# EAGLE design CW_Encoder (EAGLE 6.6.0)

## Sheet 1 of 2

## Sheet 2 of 2
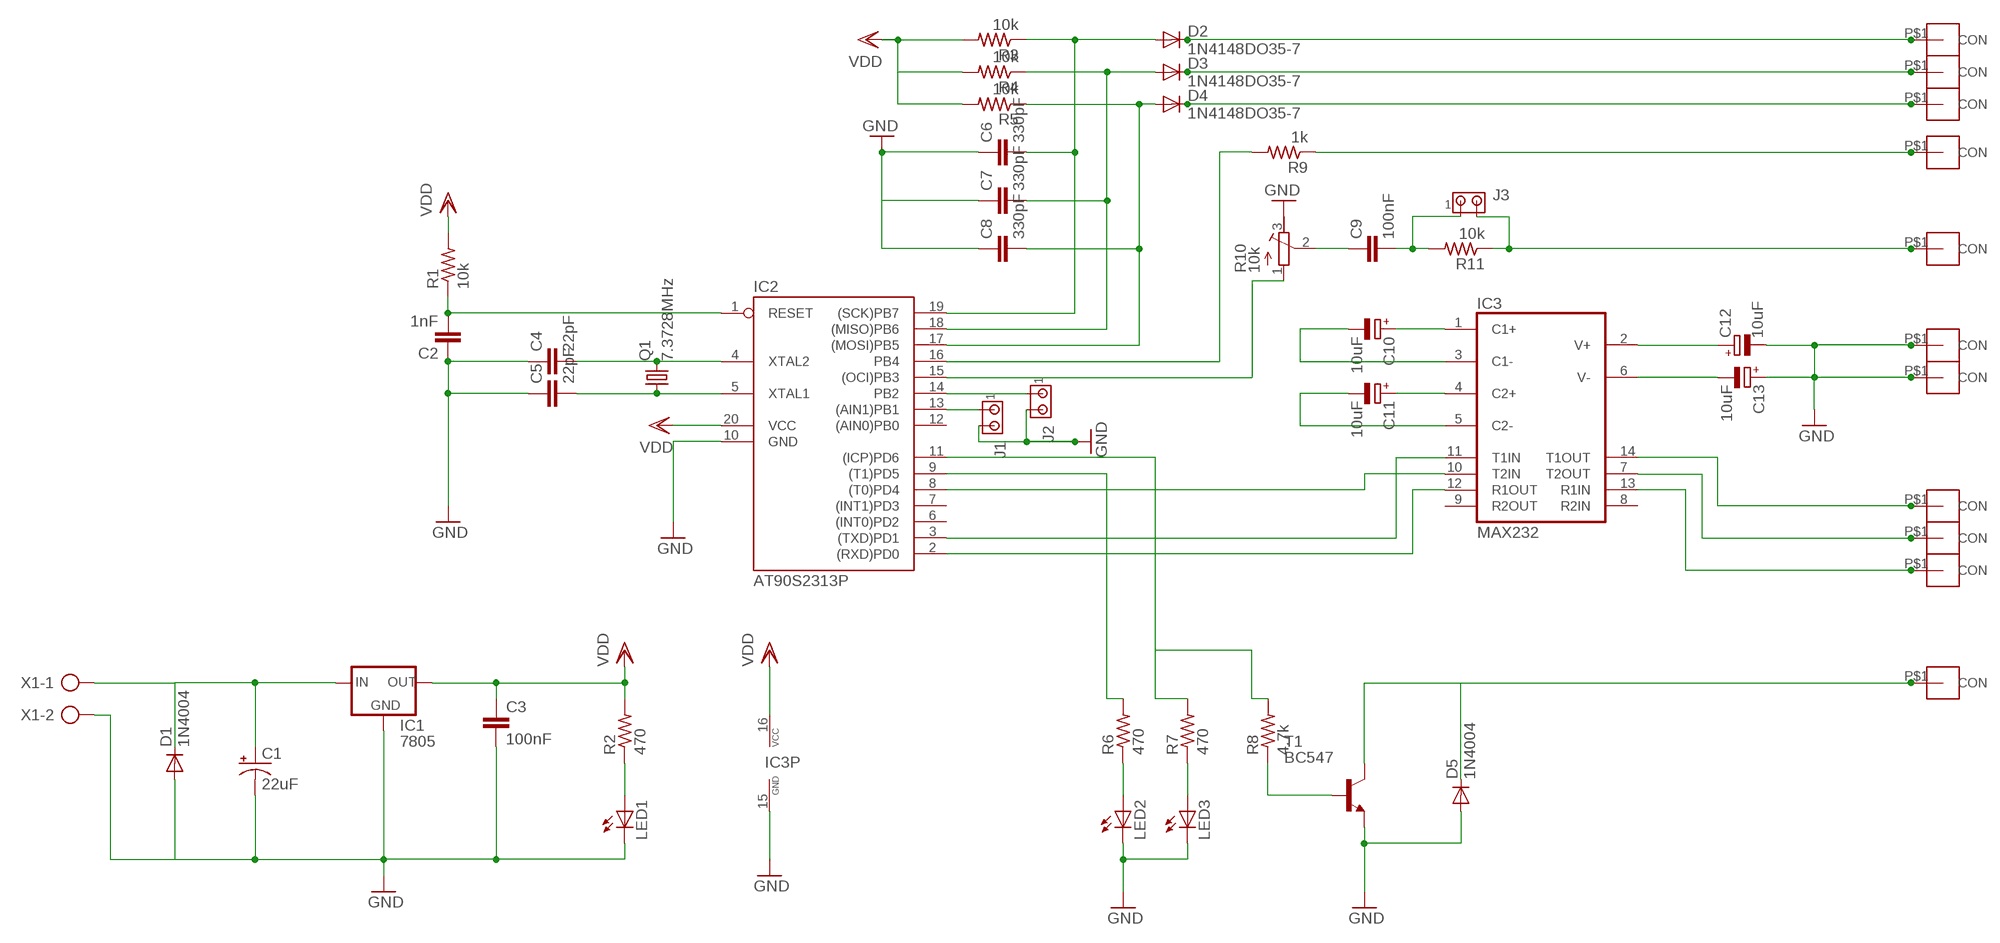
[diagram p0: schematic, sheet 2]

### Parts
C1  22uF  CPOL-USE2.5-5V  [E2,5-4R]
C2  1nF  C-EU025-024X044  [C025-024X044]
C3  100nF  C-EU025-024X044  [C025-024X044]
C4  22pF  C-EU025-024X044  [C025-024X044]
C5  22pF  C-EU025-024X044  [C025-024X044]
C6  330pF  C-EU025-024X044  [C025-024X044]
C7  330pF  C-EU025-024X044  [C025-024X044]
C8  330pF  C-EU025-024X044  [C025-024X044]
C9  100nF  C-EU025-024X044  [C025-024X044]
C10  10uF  CPOL-EUB45181A  [B45181A]
C11  10uF  CPOL-EUB45181A  [B45181A]
C12  10uF  CPOL-EUB45181A  [B45181A]
C13  10uF  CPOL-EUB45181A  [B45181A]
CTS  CON1  [CON1]
CWOUT  CON1  [CON1]
D1  1N4004  [DO41-10]
D2  1N4148DO35-7  [DO35-7]
D3  1N4148DO35-7  [DO35-7]
D4  1N4148DO35-7  [DO35-7]
D5  1N4004  [DO41-10]
GND  CON1  [CON1]
GND_  CON1  [CON1]
IC1  7805  78XXL  [78XXL]
IC2  AT90S2313P  [DIL20]
IC3  MAX232  [DIL16]
IN1  CON1  [CON1]
IN2  CON1  [CON1]
J1  MTA02-100  [10X02MTA]
J2  MTA02-100  [10X02MTA]
J3  MTA02-100  [10X02MTA]
LED1  LED5MM  [LED5MM]
LED2  LED5MM  [LED5MM]
LED3  LED5MM  [LED5MM]
POSAGOUT  CON1  [CON1]
PTT  CON1  [CON1]
Q1  7.3728MHz  CRYSTALHC49S  [HC49/S]
R1  10k  R-US_0204/7  [0204/7]
R2  470  R-US_0204/7  [0204/7]
R3  10k  R-US_0204/7  [0204/7]
R4  10k  R-US_0204/7  [0204/7]
R5  10k  R-US_0204/7  [0204/7]
R6  470  R-US_0204/7  [0204/7]
R7  470  R-US_0204/7  [0204/7]
R8  4.7k  R-US_0204/7  [0204/7]
R9  1k  R-US_0204/7  [0204/7]
R10  10k  R-TRIMM3339P  [RTRIM3339P]
R11  10k  R-US_0204/7  [0204/7]
T1  BC547  [TO92]
TX  tx  CON1  [CON1]
TXD  CON1  [CON1]
U$1  CON1  [CON1]
X1  AK300/2  [AK300/2]

### Nets
GND: C1.- C2.1 C3.2 C4.1 C5.1 C6.1 C7.1 C8.1 C12.- C13.+ D1.A D5.A GND.P$1(CON) GND_.P$1(CON) IC1.GND IC2.10(GND) IC3.15(GND) J1.2 J2.2 LED1.K(C) LED2.K(C) LED3.K(C) R10.3(A) T1.1(E) X1.2
N$1: C6.2 D2.A IC2.19((SCK)PB7) R3.1
N$2: LED1.A R2.1
N$3: C2.2 IC2.1(RESET) R1.1
N$4: C1.+ D1.C IC1.IN X1.1
N$5: C4.2 IC2.4(XTAL2) Q1.2
N$6: C5.2 IC2.5(XTAL1) Q1.1
N$7: C7.2 D3.A IC2.18((MISO)PB6) R4.1
N$8: C8.2 D4.A IC2.17((MOSI)PB5) R5.1
N$9: C10.+ IC3.1(C1+)
N$10: C10.- IC3.3(C1-)
N$11: C11.+ IC3.4(C2+)
N$12: C11.- IC3.5(C2-)
N$13: C12.+ IC3.2(V+)
N$14: C13.- IC3.6(V-)
N$15: LED3.A R7.1
N$16: LED2.A R6.1
N$17: IC2.9((T1)PD5) R6.2
N$18: IC2.11((ICP)PD6) R7.2 R8.2
N$19: IC2.3((TXD)PD1) IC3.11(T1IN)
N$20: R8.1 T1.2(B)
N$21: IC2.8((T0)PD4) IC3.10(T2IN)
N$22: IC2.2((RXD)PD0) IC3.12(R1OUT)
N$23: IC2.15((OCI)PB3) R10.1(E)
N$24: C9.1 R10.2(S)
N$25: C9.2 J3.1 R11.2
N$26: IC2.16(PB4) R9.2
N$27: IC2.14(PB2) J2.1
N$28: IC2.13((AIN1)PB1) J1.1
N$29: CWOUT.P$1(CON) J3.2 R11.1
N$30: D2.C TX.P$1(CON)
N$31: D3.C IN1.P$1(CON)
N$32: D4.C IN2.P$1(CON)
N$33: POSAGOUT.P$1(CON) R9.1
N$34: IC3.14(T1OUT) TXD.P$1(CON)
N$35: CTS.P$1(CON) IC3.7(T2OUT)
N$36: IC3.13(R1IN) U$1.P$1(CON)
N$37: D5.C PTT.P$1(CON) T1.3(C)
VDD: C3.1 IC1.OUT IC2.20(VCC) IC3.16(VCC) R1.2 R2.2 R3.2 R4.2 R5.2
Unconnected: IC2.6((INT0)PD2) IC2.7((INT1)PD3) IC2.12((AIN0)PB0) IC3.8(R2IN) IC3.9(R2OUT)

## Library data of the parts
C1 = resistor:CPOL-US: POLARIZED CAPACITOR, American symbol
C2-C9 = resistor:C-EU: CAPACITOR, European symbol
C10-C13 = resistor:CPOL-EU: POLARIZED CAPACITOR, European symbol
CTS CWOUT GND GND_ IN1 IN2 POSAGOUT PTT TX TXD U$1 = my connector:CON1: 1 pin connector
D1 D5 = diode:1N4004: DIODE general purpose rectifier, 1 A
D2-D4 = diode:1N4148: DIODE high speed (Philips)
IC1 = v-reg:78XXL: VOLTAGE REGULATOR
IC2 = atmel:AT90S2313: MICROCONTROLLER 2 Kbytes FLASH 128 bytes SRAM 128 bytes EEPROM UART; OC_FARNELL: unknown; OC_NEWARK: unknown
IC3 = maxim:MAX232: RS232 TRANSCEIVER; MF: MAXIM; MPN: MAX232ACPE+; OC_FARNELL: 9723773; OC_NEWARK: 68K4544
J1-J3 = con-amp:MTA02-100: AMP connector
LED1-LED3 = led:LED: LED OSRAM: - CHIPLED LG R971, LG N971, LY N971, LG Q971, LY Q971, LO R971, LY R971 LH N974, LH R974 LS Q976, LO Q976, LY Q976 LO Q996 - Hyper CHIPLED LW Q18S LB Q993, LB Q99A, LB R99A - SideLED LS A670, LO A670, LY A670, LG A670, LP A670 LB A673, LV A673, LT A673, LW A673 LH A674 LY A675 LS A676, LA A676, LO A676, LY A676, LW A676 LS A679, LY A679, LG A679 - Hyper Micro SIDELED® LS Y876, LA Y876, LO Y876, LY Y876 LT Y87S - SmartLED LW L88C, LW L88S LB L89C, LB L89S, LG L890 LS L89K, LO L89K, LY L89K LS L896, LA L896, LO L896, LY L896 - TOPLED LS T670, LO T670, LY T670, LG T670, LP T670 LSG T670, LSP T670, LSY T670, LOP T670, LYG T670 LG T671, LOG T671, LSG T671 LB T673, LV T673, LT T673, LW T673 LH T674 LS T676, LA T676, LO T676, LY T676, LB T676, LH T676, LSB T676, LW T676 LB T67C, LV T67C, LT T67C, LS T67K, LO T67K, LY T67K, LW E67C LS E67B, LA E67B, LO E67B, LY E67B, LB E67C, LV E67C, LT E67C LW T67C LS T679, LY T679, LG T679 LS T770, LO T770, LY T770, LG T770, LP T770 LB T773, LV T773, LT T773, LW T773 LH T774 LS E675, LA E675, LY E675, LS T675 LS T776, LA T776, LO T776, LY T776, LB T776 LHGB T686 LT T68C, LB T68C - Hyper Mini TOPLED® LB M676 - Mini TOPLED Santana® LG M470 LS M47K, LO M47K, LY M47K Source: http://www.osram.convergy.de LUXEON: - LUMILED® LXK2-PW12-R00, LXK2-PW12-S00, LXK2-PW14-U00, LXK2-PW14-V00 LXK2-PM12-R00, LXK2-PM12-S00, LXK2-PM14-U00 LXK2-PE12-Q00, LXK2-PE12-R00, LXK2-PE12-S00, LXK2-PE14-T00, LXK2-PE14-U00 LXK2-PB12-K00, LXK2-PB12-L00, LXK2-PB12-M00, LXK2-PB14-N00, LXK2-PB14-P00, LXK2-PB14-Q00 LXK2-PR12-L00, LXK2-PR12-M00, LXK2-PR14-Q00, LXK2-PR14-R00 LXK2-PD12-Q00, LXK2-PD12-R00, LXK2-PD12-S00 LXK2-PH12-R00, LXK2-PH12-S00 LXK2-PL12-P00, LXK2-PL12-Q00, LXK2-PL12-R00 Source: www.luxeon.com KINGBRIGHT: KA-3528ASYC Source: www.kingbright.com
Q1 = crystal:CRYSTAL: CRYSTAL; OC_FARNELL: 1667008; OC_NEWARK: unknown
R1-R9 R11 = resistor:R-US_: RESISTOR, American symbol
R10 = resistor:R-TRIMM: Trimm resistor
T1 = transistor:BC547: NPN TRANSISTOR
X1 = con-ptr500:AK300/2: CONNECTOR; OC_FARNELL: unknown; OC_NEWARK: unknown

## Board
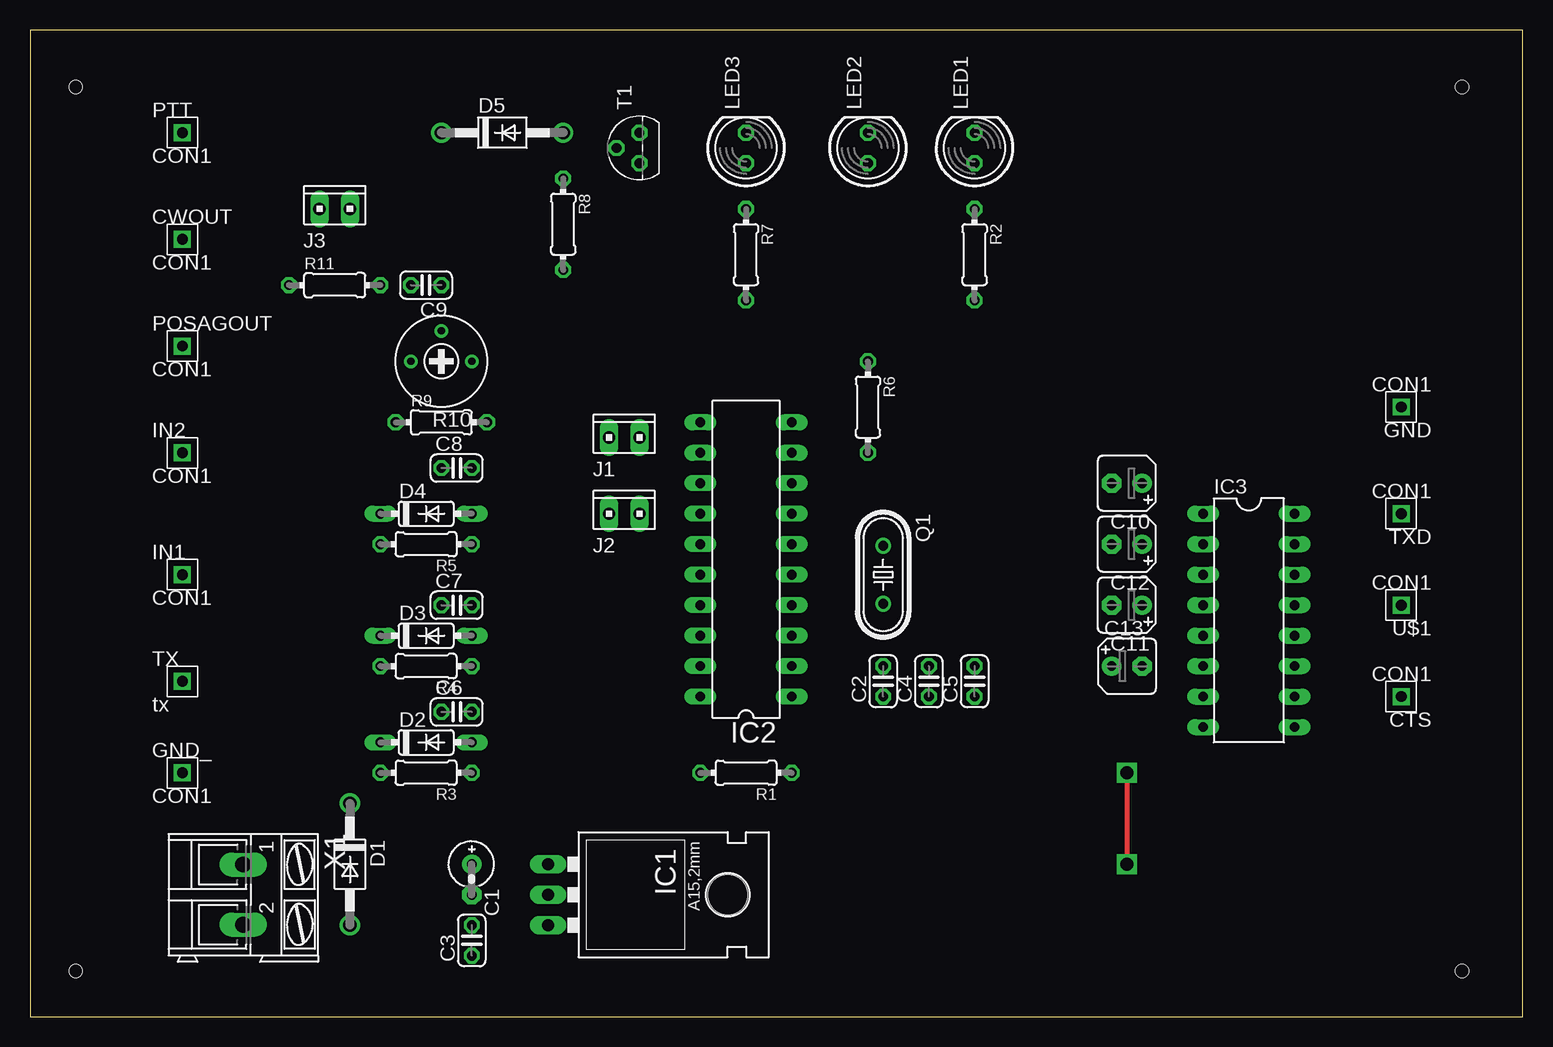
[diagram p1: board, top side]
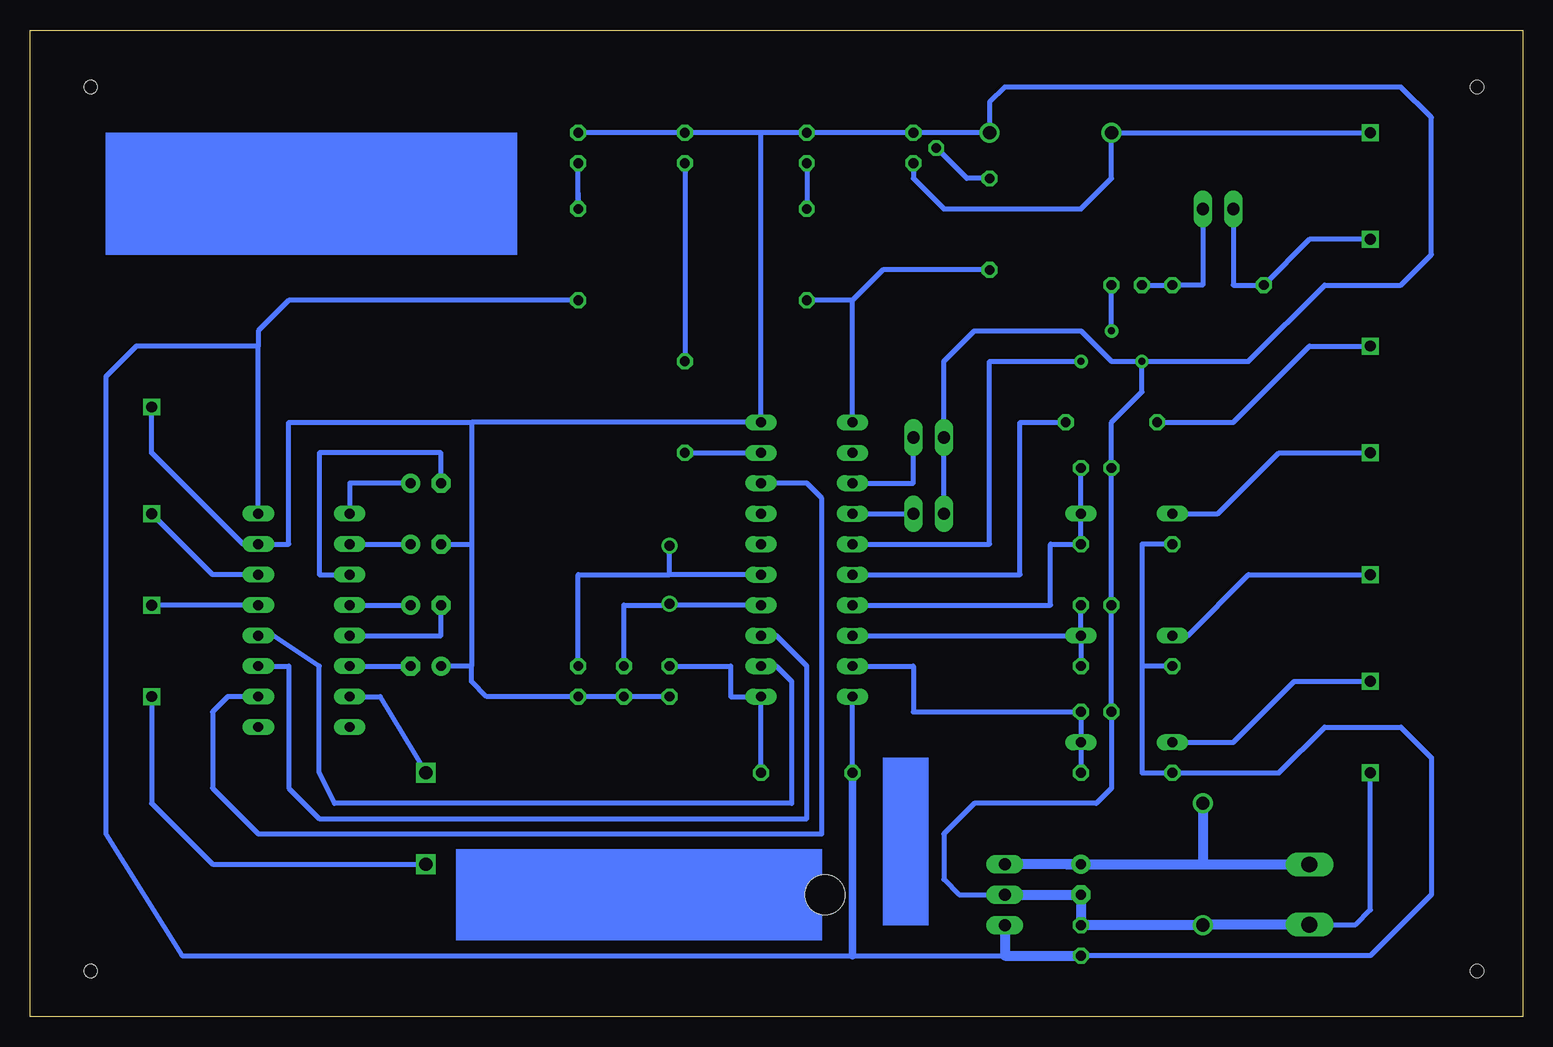
[diagram p2: board, bottom side, seen from below]

Size 124.44 x 82.22 mm. Coordinates in mm from the lower left corner, seen from the top.
Outline: 0,0 124.44,0 124.44,82.22 0,82.22 0,0
Copper layers (1*16): Top 0.035mm / dielectric 1.5mm / Bottom 0.035mm
Design rules "default": minimum track width 10mil, minimum drill 24mil, track to track 8mil, track to pad 8mil, pad to pad 8mil, via to via 8mil, smd to smd 8mil, copper to edge 40mil, drill to drill 8mil, minimum pad ring 10mil, minimum via ring 8mil, stop-mask expansion 4mil, vias tented up to drill 0mil, thermal gap 10mil
Holes 1.1 mm at 3.81,77.47 3.81,3.81 119.38,3.81 119.38,77.47

### Footprints (pad centres in the part's own frame; a part is rotated, then mirrored left to right if it is on the bottom)
E2,5-4R = drill 0.813 pad 1.6: + -1.27,0 | drill 0.813 pad 1.6 octagon: - 1.27,0
C025-024X044 = drill 0.813 octagon: 1 -1.27,0; 2 1.27,0
B45181A = drill 0.813 pad 1.6: + -1.27,0 | drill 0.813 pad 1.6 octagon: - 1.27,0
CON1 = drill 0.9 square: P$1 0,0
DO41-10 = drill 1.118: A 5.08,0; C -5.08,0
DO35-7 = drill 0.813 long: A 3.81,0; C -3.81,0
78XXL = drill 1.016 long: GND 0,-3.81; IN -2.54,-3.81; OUT 2.54,-3.81 | hole 3.302: 0,11.176
DIL20 = drill 0.813 long: 1 -11.43,-3.81; 2 -8.89,-3.81; 3 -6.35,-3.81; 4 -3.81,-3.81; 5 -1.27,-3.81; 6 1.27,-3.81; 7 3.81,-3.81; 8 6.35,-3.81; 9 8.89,-3.81; 10 11.43,-3.81; 11 11.43,3.81; 12 8.89,3.81; 13 6.35,3.81; 14 3.81,3.81; 15 1.27,3.81; 16 -1.27,3.81; 17 -3.81,3.81; 18 -6.35,3.81; 19 -8.89,3.81; 20 -11.43,3.81
DIL16 = drill 0.813 long: 1 -8.89,-3.81; 2 -6.35,-3.81; 3 -3.81,-3.81; 4 -1.27,-3.81; 5 1.27,-3.81; 6 3.81,-3.81; 7 6.35,-3.81; 8 8.89,-3.81; 9 8.89,3.81; 10 6.35,3.81; 11 3.81,3.81; 12 1.27,3.81; 13 -1.27,3.81; 14 -3.81,3.81; 15 -6.35,3.81; 16 -8.89,3.81
10X02MTA = drill 1.016 long: 1 1.27,0; 2 -1.27,0
LED5MM = drill 0.813 octagon: A -1.27,0; K 1.27,0
HC49/S = drill 0.813: 1 -2.413,0; 2 2.413,0
0204/7 = drill 0.813 octagon: 1 -3.81,0; 2 3.81,0
RTRIM3339P = drill 0.61: 1 -2.54,0; 2 0,-2.54; 3 2.54,0
TO92 = drill 0.813 octagon: 1 1.27,0; 2 0,1.905; 3 -1.27,0
AK300/2 = drill 1.321 long: 1 -2.515,0; 2 2.489,0

### Placement (x,y rotation side)
C1  36.83,11.43 270 top
C2  71.12,27.94 90 top
C3  36.83,6.35 90 top
C4  74.93,27.94 90 top
C5  78.74,27.94 90 top
C6  35.56,25.4 0 top
C7  35.56,34.29 0 top
C8  35.56,45.72 0 top
C9  33.02,60.96 180 top
C10  91.44,44.45 180 top
C11  91.44,34.29 180 top
C12  91.44,39.37 180 top
C13  91.44,29.21 0 top
CTS  114.3,26.67 180 top
CWOUT  12.7,64.77 0 top
D1  26.67,12.7 270 top
D2  33.02,22.86 0 top
D3  33.02,31.75 0 top
D4  33.02,41.91 0 top
D5  39.37,73.66 0 top
GND  114.3,50.8 180 top
GND_  12.7,20.32 0 top
IC1  46.99,10.16 270 top
IC2  59.69,38.1 90 top
IC3  101.6,33.02 270 top
IN1  12.7,36.83 0 top
IN2  12.7,46.99 0 top
J1  49.53,48.26 0 top
J2  49.53,41.91 0 top
J3  25.4,67.31 0 top
LED1  78.74,72.39 90 top
LED2  69.85,72.39 90 top
LED3  59.69,72.39 90 top
POSAGOUT  12.7,55.88 0 top
PTT  12.7,73.66 0 top
Q1  71.12,36.83 270 top
R1  59.69,20.32 180 top
R2  78.74,63.5 270 top
R3  33.02,20.32 180 top
R4  33.02,29.21 180 top
R5  33.02,39.37 180 top
R6  69.85,50.8 270 top
R7  59.69,63.5 270 top
R8  44.45,66.04 270 top
R9  34.29,49.53 0 top
R10  34.29,54.61 180 top
R11  25.4,60.96 0 top
T1  50.8,72.39 90 top
TX  12.7,27.94 0 top
TXD  114.3,41.91 180 top
U$1  114.3,34.29 180 top
X1  17.78,10.16 270 top

### Tracks (layer width: path | path; a pad name or v marks a point on that pad's centre or on a via)
GND
  Bottom 0.406: C2.1 C4.1 C5.1 86.36,26.67 87.63,27.94 87.63,29.21 | 63.5,73.66 LED3.K T1.1 D5.A 44.45,76.2 43.18,77.47 10.16,77.47 7.62,74.93 7.62,63.5 10.16,60.96 16.51,60.96 22.86,54.61 R10.3 | 63.5,73.66 LED2.K LED1.K | C12.- 87.63,39.37 | 87.63,39.37 87.63,29.21 | 87.63,29.21 C13.+ | 87.63,49.53 102.87,49.53 102.87,39.37 IC3.15 106.68,39.37 114.3,46.99 GND.P$1 | 87.63,49.53 87.63,39.37 | J2.2 J1.2 48.26,54.61 45.72,57.15 36.83,57.15 34.29,54.61 R10.3 | 87.63,49.53 IC2.10 63.5,73.66 | X1.2 13.92,7.67 12.7,8.89 GND_.P$1 | R10.3 31.75,52.07 34.29,49.53 C8.1 C7.1 C6.1 34.29,19.05 35.56,17.78 45.72,17.78 48.26,15.24 48.26,11.43 46.99,10.16 IC1.GND
  Bottom 0.813: IC1.GND C1.- C3.2 D1.A 26.62,7.67 X1.2
N$1
  Bottom 0.406: IC2.19 50.8,29.21 50.8,25.4 C6.2 D2.A R3.1
N$2
  Bottom 0.406: 78.74,68.58 R2.1 LED1.A
N$3
  Bottom 0.406: C2.2 66.04,29.21 66.04,26.67 IC2.1 R1.1
N$4
  Bottom 0.813: 38.1,12.7 C1.+ | C1.+ IC1.IN | C1.+ 26.67,12.7 | 26.67,12.7 17.8,12.7 X1.1 | D1.C 26.67,12.7
N$5
  Bottom 0.406: IC2.4 71.12,34.29 | C4.2 74.93,34.29 71.12,34.29 | 71.12,34.29 Q1.2
N$6
  Bottom 0.406: IC2.5 71.12,36.83 | 71.12,36.83 Q1.1 | C5.2 78.74,36.83 71.12,36.83
N$7
  Bottom 0.406: IC2.18 D3.A | D3.A C7.2 | D3.A R4.1
N$8
  Bottom 0.406: C8.2 D4.A R5.1 39.37,39.37 39.37,34.29 IC2.17
N$9
  Bottom 0.406: C10.+ 97.79,44.45 IC3.1
N$10
  Bottom 0.406: C10.- 90.17,46.99 100.33,46.99 100.33,36.83 IC3.3
N$11
  Bottom 0.406: IC3.4 C11.+
N$12
  Bottom 0.406: IC3.5 90.17,31.75 C11.-
N$13
  Bottom 0.406: IC3.2 C12.+
N$14
  Bottom 0.406: IC3.6 C13.-
N$15
  Bottom 0.406: LED3.A R7.1
N$16
  Bottom 0.406: LED2.A R6.1
N$17
  Bottom 0.406: R6.2 IC2.9
N$18
  Bottom 0.406: 55.88,59.69 R7.2 | IC2.11 55.88,59.69 | R8.2 53.34,62.23 55.88,59.69
N$19
  Bottom 0.406: IC3.11 102.87,29.21 102.87,19.05 100.33,16.51 59.69,16.51 59.69,29.21 62.23,31.75 IC2.3
N$20
  Bottom 0.406: R8.1 46.36,69.85 T1.2
N$21
  Bottom 0.406: IC3.10 107.95,26.67 109.22,25.4 109.22,19.05 105.41,15.24 58.42,15.24 58.42,43.18 59.69,44.45 IC2.8
N$22
  Bottom 0.406: IC2.2 62.23,29.21 60.96,27.94 60.96,17.78 99.06,17.78 100.33,20.32 100.33,29.21 104.14,31.75 IC3.12
N$23
  Bottom 0.406: IC2.15 44.45,39.37 44.45,54.61 R10.1
N$24
  Bottom 0.406: R10.2 C9.1
N$25
  Bottom 0.406: C9.2 R11.2 26.67,60.96 J3.1
N$26
  Bottom 0.406: IC2.16 41.91,36.83 41.91,49.53 R9.2
N$27
  Bottom 0.406: IC2.14 J2.1
N$28
  Bottom 0.406: IC2.13 50.8,44.45 J1.1
N$29
  Bottom 0.406: J3.2 24.13,60.96 R11.1 17.78,64.77 CWOUT.P$1
N$30
  Bottom 0.406: D2.C 24.13,22.86 19.05,27.94 TX.P$1
N$31
  Bottom 0.406: D3.C 27.94,31.75 22.86,36.83 IN1.P$1
N$32
  Bottom 0.406: D4.C 25.4,41.91 20.32,46.99 IN2.P$1
N$33
  Bottom 0.406: R9.1 24.13,49.53 17.78,55.88 POSAGOUT.P$1
N$34
  Bottom 0.406: IC3.14 109.22,36.83 TXD.P$1
N$35  (via drill 1.1)
  Top 0.406: v91.44,20.32 91.44,12.7
  Bottom 0.406: CTS.P$1 114.3,17.78 109.22,12.7 91.44,12.7 | IC3.7 95.25,26.67 v91.44,20.32
N$36
  Bottom 0.406: IC3.13 U$1.P$1
N$37
  Bottom 0.406: PTT.P$1 D5.C 34.29,69.85 36.83,67.31 48.26,67.31 50.8,69.85 T1.3
N$39  (via drill 1.1)
  other vias: 91.44,12.7
VDD
  Bottom 0.406: R5.2 31.75,39.37 31.75,29.21 | 31.75,29.21 31.75,20.32 R3.2 20.32,20.32 16.51,24.13 10.16,24.13 7.62,21.59 7.62,10.16 12.7,5.08 C3.1 | R4.2 31.75,29.21 | R1.2 IC2.20 | IC3.16 105.41,55.88 | 105.41,55.88 115.57,55.88 118.11,53.34 118.11,15.24 111.76,5.08 55.88,5.08 43.18,5.08 | R2.2 102.87,59.69 105.41,57.15 105.41,55.88
  Bottom 0.61: R1.2 55.88,5.08
  Bottom 0.813: IC1.OUT 43.18,5.08 C3.1
(copper drawn outside any net)
  shapes: Bottom area x3